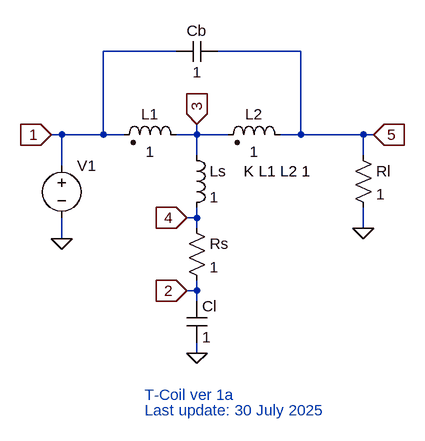
[diagram p0: schematic T-Coil-ver1a.asc]
T-Coil-ver1a.asc, the LTspice schematic file:
Version 4
SHEET 1 880 680
WIRE 320 -128 208 -128
WIRE 512 -128 384 -128
WIRE 144 0 128 0
WIRE 208 0 208 -128
WIRE 208 0 144 0
WIRE 240 0 208 0
WIRE 352 0 352 -16
WIRE 352 0 320 0
WIRE 400 0 352 0
WIRE 512 0 512 -128
WIRE 512 0 480 0
WIRE 608 0 512 0
WIRE 624 0 608 0
WIRE 352 32 352 0
WIRE 608 32 608 0
WIRE 144 48 144 0
WIRE 352 128 352 112
WIRE 352 128 336 128
WIRE 352 144 352 128
WIRE 608 144 608 112
WIRE 144 160 144 128
WIRE 352 240 352 224
WIRE 352 240 336 240
WIRE 352 256 352 240
WIRE 352 336 352 320
FLAG 144 160 0
FLAG 352 336 0
FLAG 608 144 0
FLAG 128 0 1
IOPIN 128 0 In
FLAG 352 -16 3
IOPIN 352 -16 In
FLAG 624 0 5
IOPIN 624 0 In
FLAG 336 128 4
IOPIN 336 128 In
FLAG 336 240 2
IOPIN 336 240 In
SYMBOL voltage 144 32 R0
WINDOW 3 24 96 Invisible 2
WINDOW 123 0 0 Left 0
WINDOW 39 0 0 Left 0
SYMATTR Value 1
SYMATTR InstName V1
SYMBOL ind2 336 16 M270
WINDOW 0 32 56 VTop 2
WINDOW 3 5 56 VBottom 2
SYMATTR InstName L1
SYMATTR Value 1
SYMATTR Type ind
SYMBOL ind2 496 16 M270
WINDOW 0 32 56 VTop 2
WINDOW 3 5 56 VBottom 2
SYMATTR InstName L2
SYMATTR Value 1
SYMATTR Type ind
SYMBOL ind 336 16 R0
SYMATTR InstName Ls
SYMATTR Value 1
SYMBOL cap 336 256 R0
SYMATTR InstName Cl
SYMATTR Value 1
SYMBOL cap 384 -144 R90
WINDOW 0 0 32 VBottom 2
WINDOW 3 32 32 VTop 2
SYMATTR InstName Cb
SYMATTR Value 1
SYMBOL res 592 16 R0
SYMATTR InstName Rl
SYMATTR Value 1
SYMBOL res 336 128 R0
SYMATTR InstName Rs
SYMATTR Value 1
TEXT 424 56 Left 2 !K L1 L2 1
TEXT 272 400 Left 2 ;T-Coil ver 1a
TEXT 272 424 Left 2 ;Last update: 30 July 2025

The netlist it stands for:
* T-Coil-ver1a.asc
V1 1 0 1
L1 3 1 1
L2 5 3 1
Ls 3 4 1
Cl 2 0 1
Cb 5 1 1
Rl 5 0 1
Rs 4 2 1
K L1 L2 1
* T-Coil ver 1a
* Last update: 30 July 2025
.backanno
.end